# EasyEDA Pro project ProProject_FPGA_oscilloscope Analog pre circuit PCB_2024-05-13.epro, board PCB3
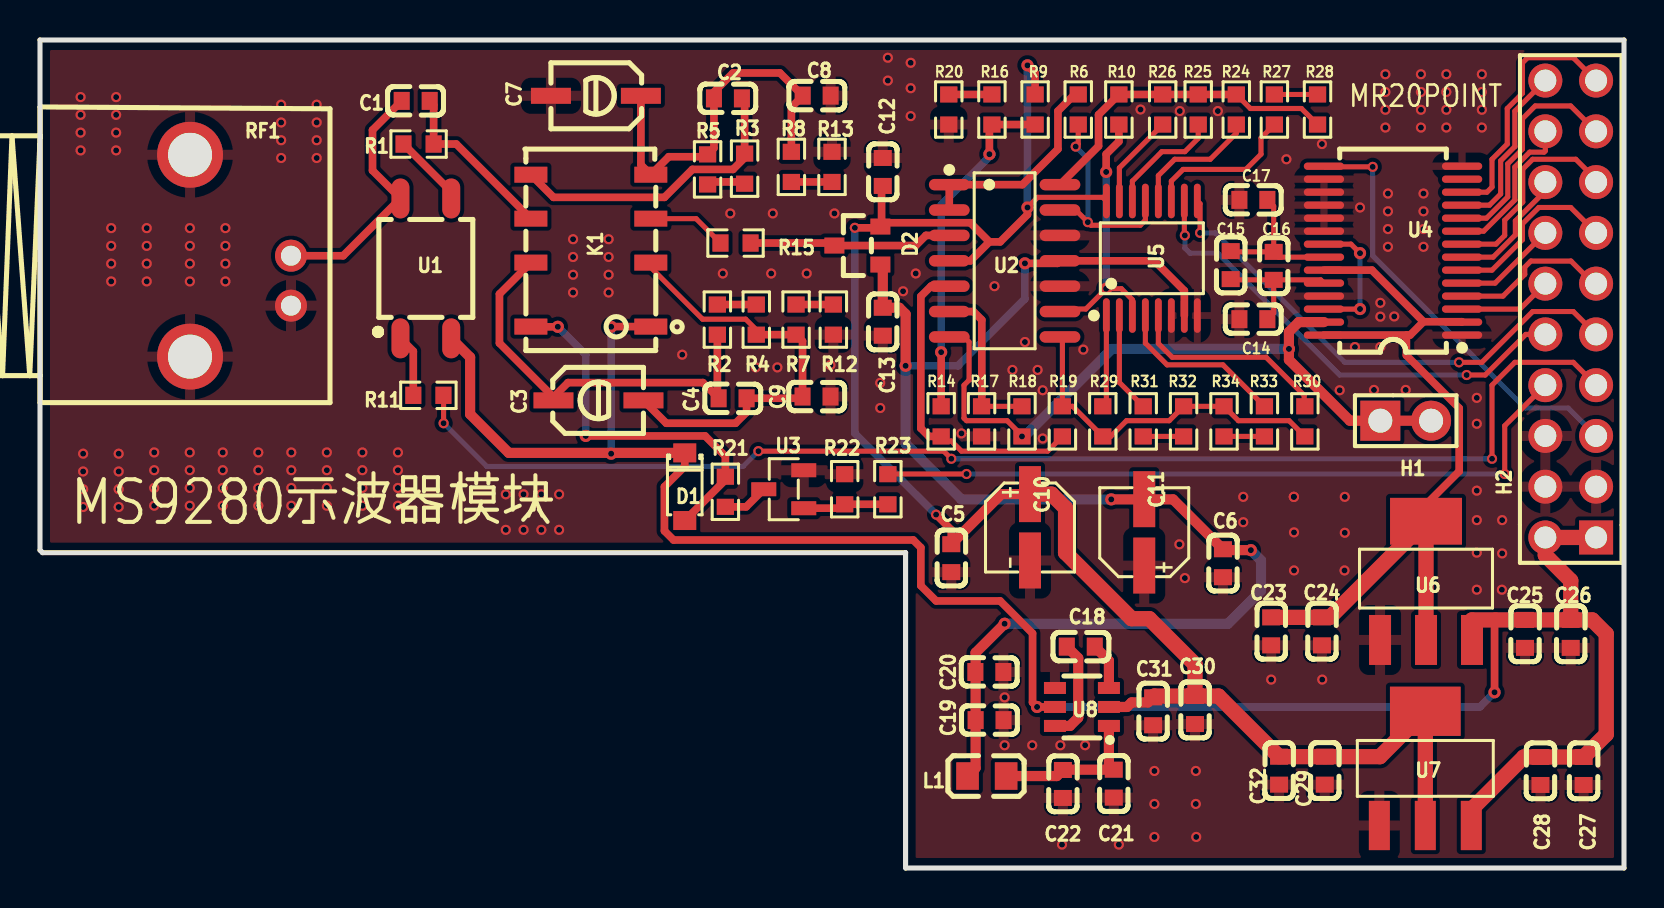
[diagram p5: board, top side]
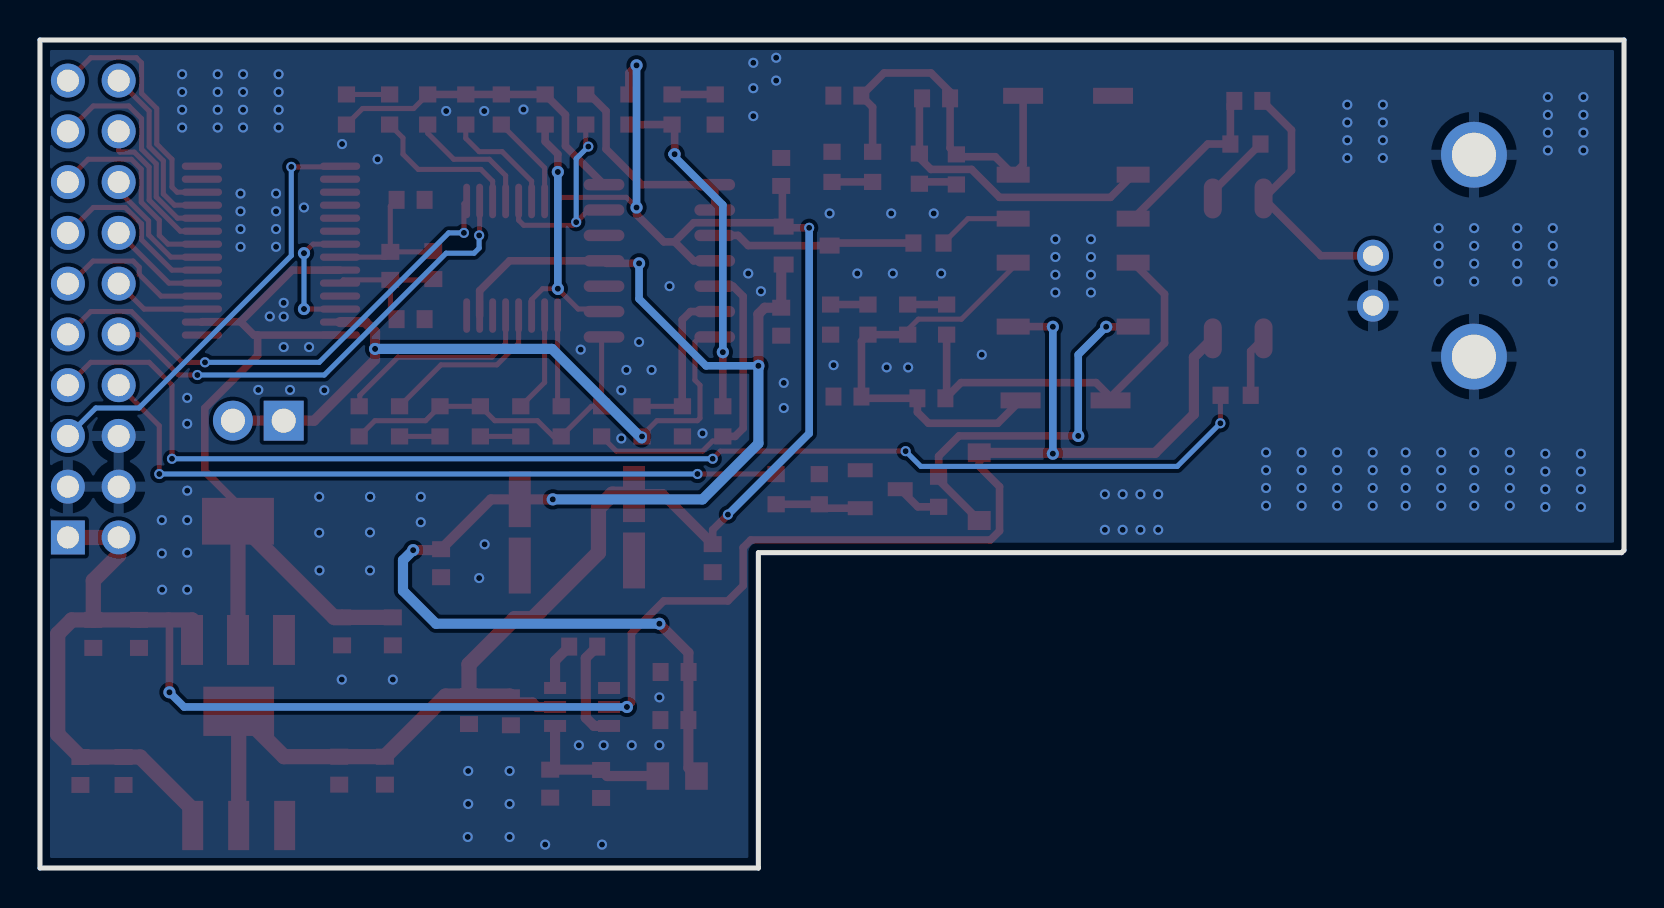
[diagram p6: board, bottom side, seen from below]

Outline 79.25 x 41.43 mm; copper layers: Top Layer, Bottom Layer. Coordinates in mm from the lower left corner of the outline.
Outline path: 0,41.43 79.25,41.43 79.25,0 43.31,0 43.31,15.78 0.13,15.78 0,15.91 0,41.43
Stack: Top Layer 0.035mm / Dielectric1 1.51mm FR4 er 4.5 / Bottom Layer 0.035mm

## Design rules (mm)
template: JLCPCB Capability(Two Layers Board)
spacing copperThickness1oz (default): track to track 0.102, other pairs 0.152 to 0.3
spacing copperThickness2oz: track to track 0.203, other pairs 0.152 to 0.3
track width copperThickness1oz (default): min 0.127, default 0.254, max 2.54
track width copperThickness2oz: min 0.203, default 0.254, max 2.54
differential pair differentialPair (default): width min 0.127, default 0.254, max 2.54; gap min 0.152, default 0.152
via viaSize (default): diameter min 0.5, default 0.61, max 10; hole min 0.3, default 0.305, max 6.3

## Placement (name value [footprint] x y rotation side)
C1  22nF  [C0603]  18.8 38.38 0 top
C2  360pf  [C0603]  34.42 38.51 0 top
C3  -  [CAP-SMD_L4.50-W3.20]  27.94 23.4 0 top
C4  15Pf  [C0603]  34.65 23.5 180 top
C5  104pf  [C0603]  45.59 15.5 270 top
C6  104pf  [C0603]  59.18 15.25 270 top
C7  -  [CAP-SMD_L4.50-W3.20]  27.81 38.64 180 top
C8  15Pf  [C0603]  38.86 38.65 180 top
C9  360pf  [C0603]  38.85 23.59 180 top
C10  22uF  [CAP-SMD_BD4.0-L4.3-W4.3-FD-A]  49.53 17.05 270 top
C11  22uF  [CAP-SMD_BD4.0-L4.3-W4.3-FD-A]  55.25 16.79 90 top
C12  360pf  [C0603]  42.16 34.83 270 top
C13  360pf  [C0603]  42.16 27.34 90 top
C14  100nf  [C0603]  60.71 27.46 0 top
C15  100nf  [C0603]  59.57 30.17 270 top
C16  10uf  [C0603]  61.72 30.13 270 top
C17  100nf  [C0603]  60.71 33.43 0 top
C18  47uf  [C0603]  52.07 11.08 180 top
C19  10uf  [C0603]  47.51 7.4 0 top
C20  47uf  [C0603]  47.5 9.81 0 top
C21  10uf  [C0603]  53.72 4.22 270 top
C22  4.7uf  [C0603]  51.18 4.21 270 top
C23  100nf  [C0603]  61.59 11.84 270 top
C24  22uf  [C0603]  64.13 11.84 270 top
C25  10uf  [C0603]  74.3 11.71 270 top
C26  100nf  [C0603]  76.58 11.71 270 top
C27  100nf  [C0603]  77.23 4.86 270 top
C28  10uf  [C0603]  75.07 4.86 270 top
C29  22uf  [C0603]  64.28 4.87 270 top
C30  10uf  [C0603]  57.78 7.9 270 top
C31  47uf  [C0603]  55.69 7.84 270 top
C32  100nf  [C0603]  61.99 4.87 270 top
D1  1N4148W  [SOD-123_L2.8-W1.8-LS3.7-RD]  32.26 19.08 270 top
D2  BAV199LT1G  [SOT-23_L2.9-W1.3-P1.90-LS2.4-BR]  40.89 31.15 0 top
H1  PZ254V-11-02P  [HDR-TH_2P-P2.54-V-M]  68.33 22.38 0 top
H2  PZ254V-12-20P  [HDR-TH_20P-P2.54-V-M-R2-C10-S2.54]  76.58 27.97 90 top
K1  HFD4/3-S1R  [RELAY-SMD_HFD4-3-S1R]  27.56 30.89 90 top
L1  YI201209U121-5R0T  [L0805]  47.37 4.6 0 top
R1  56Ω  [R0603]  18.94 36.23 180 top
R2  680kΩ  [R0603]  33.89 27.44 270 top
R3  300kΩ  [R0603]  35.25 34.99 90 top
R4  300kΩ  [R0603]  35.84 27.44 90 top
R5  300kΩ  [R0603]  33.4 34.96 270 top
R6  1.5kΩ  [R0603]  51.94 37.95 90 top
R7  4kΩ  [R0603]  37.83 27.44 270 top
R8  200kΩ  [R0603]  37.59 35.08 90 top
R9  1.5kΩ  [R0603]  49.78 37.95 90 top
R10  1.5kΩ  [R0603]  53.97 37.95 90 top
R11  1kΩ  [R0603]  19.43 23.65 180 top
R12  16kΩ  [R0603]  39.69 27.44 90 top
R13  200kΩ  [R0603]  39.62 35.08 270 top
R14  200kΩ  [R0603]  45.09 22.35 90 top
R15  100R  [R0603]  34.8 31.27 0 top
R16  3kΩ  [R0603]  47.62 37.95 270 top
R17  200kΩ  [R0603]  47.11 22.35 90 top
R18  200kΩ  [R0603]  49.13 22.35 90 top
R19  200kΩ  [R0603]  51.15 22.35 270 top
R20  3kΩ  [R0603]  45.47 37.95 90 top
R21  100R  [R0603]  34.29 18.83 270 top
R22  10K  [R0603]  40.26 18.95 270 top
R23  100R  [R0603]  42.42 18.95 270 top
R24  1.5kΩ  [R0603]  59.85 37.95 90 top
R25  1.5kΩ  [R0603]  57.95 37.95 90 top
R26  3kΩ  [R0603]  56.17 37.95 90 top
R27  3kΩ  [R0603]  61.76 37.95 90 top
R28  1.5kΩ  [R0603]  63.91 37.95 270 top
R29  1.5kΩ  [R0603]  53.17 22.35 270 top
R30  3kΩ  [R0603]  63.28 22.35 270 top
R31  3kΩ  [R0603]  55.19 22.35 270 top
R32  1.5kΩ  [R0603]  57.21 22.35 90 top
R33  3kΩ  [R0603]  61.26 22.35 270 top
R34  3kΩ  [R0603]  59.24 22.35 90 top
RF1  KH-BNC75-3511  [ANT-TH_KH-BNC75-3511]  10.03 30.64 270 top
U1  AQY282SX  [SOP-4_L4.3-W4.4-P2.54-LS7.0-BL]  19.3 30 0 top
U2  GS8094-SR  [SOIC-14_L8.7-W3.9-P1.27-LS6.0-BL]  48.26 30.38 270 top
U3  SI2302ADS-T1-JSM  [SOT-23-3_L2.9-W1.3-P1.90-LS2.4-BR]  37.21 18.95 0 top
U4  MS9280  [SSOP-28_L10.2-W5.3-P0.65-LS7.8-BL]  67.69 30.89 90 top
U5  74HC4052PW,118  [TSSOP-16_L5.0-W4.4-P0.65-LS6.4-BL]  55.63 30.51 0 top
U6  AMS1117-3.3  [SOT-223-3_L6.5-W3.5-P3.05-LS7.0]  69.34 14.38 270 top
U7  AMS1117-2.5V  [SOT-223_L6.5-W3.5-P2.30-LS7.0-BR]  69.31 4.99 270 top
U8  SGM3204YN6G/TR  [SOT-23-6_L2.9-W1.6-P0.95-LS2.8-BR]  52.13 8.06 0 top

## Footprints (pads in the part's own frame, mm; a bottom-side part is the same pattern mirrored in y, then rotated)
ANT-TH_KH-BNC75-3511
  round 1.6 hole 1: 1(0,2.525) 2(2.5,2.525)
  round 3.3 hole 2.2: 3(5.05,-2.525) 4(-5.05,-2.525)
C0603
  rect 0.8x0.9 smd: 1(-0.7,0) 2(0.7,0)
CAP-SMD_BD4.0-L4.3-W4.3-FD-A
  rect 2.8x1.1 smd: 1(-1.661,0) 2(1.661,0)
CAP-SMD_L4.50-W3.20
  rect 2x0.8 smd: 1(-2.25,0) 2(2.25,0)
HDR-TH_2P-P2.54-V-M
  rect 2x2 hole 1.2: 1(-1.27,0)
  round 2 hole 1.2: 2(1.27,0)
HDR-TH_20P-P2.54-V-M-R2-C10-S2.54
  rect 1.7x1.7 hole 1.1: 1(-11.43,-1.27)
  round 1.7 hole 1.1: 2(-11.43,1.27) 3(-8.89,-1.27) 4(-8.89,1.27) 5(-6.35,-1.27) 6(-6.35,1.27) 7(-3.81,-1.27) 8(-3.81,1.27) 9(-1.27,-1.27) 10(-1.27,1.27) 11(1.27,-1.27) 12(1.27,1.27) 13(3.81,-1.27) 14(3.81,1.27) 15(6.35,-1.27) 16(6.35,1.27) 17(8.89,-1.27) 18(8.89,1.27) 19(11.43,-1.27) 20(11.43,1.27)
L0805
  rect 1.133x1.377 smd: 1(-0.966,0) 2(0.966,0)
R0603
  rect 0.806x0.864 smd: 1(-0.753,0) 2(0.753,0)
RELAY-SMD_HFD4-3-S1R
  rect 0.8x1.65 smd: 1(-3.8,-3) 2(-0.6,-3) 3(1.6,-3) 4(3.8,-3) 5(3.8,3) 6(1.6,3) 7(-0.6,3) 8(-3.8,3)
SOD-123_L2.8-W1.8-LS3.7-RD
  rect 0.95x1.15 smd: 1(-1.692,0) 2(1.692,0)
SOIC-14_L8.7-W3.9-P1.27-LS6.0-BL
  oval 0.574x2.038 smd: 1(-3.81,-2.769) 2(-2.54,-2.769) 3(-1.27,-2.769) 4(0,-2.769) 5(1.27,-2.769) 6(2.54,-2.769) 7(3.81,-2.769) 8(3.81,2.769) 9(2.54,2.769) 10(1.27,2.769) 11(0,2.769) 12(-1.27,2.769) 13(-2.54,2.769) 14(-3.81,2.769)
SOP-4_L4.3-W4.4-P2.54-LS7.0-BL
  oval 0.9x2 smd: 1(-1.27,-3.5) 2(1.27,-3.5) 3(1.27,3.5) 4(-1.27,3.5)
SOT-23-3_L2.9-W1.3-P1.90-LS2.4-BR
  rect 1.25x0.7 smd: 1(1,-0.95) 2(1,0.95) 3(-1,0)
SOT-23-6_L2.9-W1.6-P0.95-LS2.8-BR
  rect 1.1x0.6 smd: 1(1.35,-0.95) 2(1.35,0) 3(1.35,0.95) 4(-1.35,0.95) 5(-1.35,0) 6(-1.35,-0.95)
SOT-23_L2.9-W1.3-P1.90-LS2.4-BR
  rect 1x0.8 smd: 1(1.15,-0.95) 2(1.15,0.95) 3(-1.15,0)
SOT-223-3_L6.5-W3.5-P3.05-LS7.0
  rect 2.5x1.1 smd: 1(2.97,-2.3) 2(2.97,0) 3(2.97,2.3)
  rect 2.34x3.6 smd: 4(-2.97,0)
SOT-223_L6.5-W3.5-P2.30-LS7.0-BR
  rect 2.465x1.05 smd: 1(2.857,-2.3) 2(2.857,0) 3(2.857,2.3)
  rect 2.465x3.54 smd: 4(-2.857,0)
SSOP-28_L10.2-W5.3-P0.65-LS7.8-BL
  oval 0.364x2.015 smd: 1(-4.225,-3.455) 2(-3.575,-3.455) 3(-2.925,-3.455) 4(-2.275,-3.455) 5(-1.625,-3.455) 6(-0.975,-3.455) 7(-0.325,-3.455) 8(0.325,-3.455) 9(0.975,-3.455) 10(1.625,-3.455) 11(2.275,-3.455) 12(2.925,-3.455) 13(3.575,-3.455) 14(4.225,-3.455) 15(4.225,3.455) 16(3.575,3.455) 17(2.925,3.455) 18(2.275,3.455) 19(1.625,3.455) 20(0.975,3.455) 21(0.325,3.455) 22(-0.325,3.455) 23(-0.975,3.455) 24(-1.625,3.455) 25(-2.275,3.455) 26(-2.925,3.455) 27(-3.575,3.455) 28(-4.225,3.455)
TSSOP-16_L5.0-W4.4-P0.65-LS6.4-BL
  oval 0.343x1.732 smd: 1(-2.275,-2.866) 2(-1.625,-2.866) 3(-0.975,-2.866) 4(-0.325,-2.866) 5(0.325,-2.866) 6(0.975,-2.866) 7(1.625,-2.866) 8(2.275,-2.866) 9(2.275,2.866) 10(1.625,2.866) 11(0.975,2.866) 12(0.325,2.866) 13(-0.325,2.866) 14(-0.975,2.866) 15(-1.625,2.866) 16(-2.275,2.866)

## Nets
2.5V: C5.1 C10.1 C12.2 C29.1 C30.1 C31.1 C32.1 D2.2 R9.2 U2.4 U5.16 U7.2 U7.4 U8.2
+5V: C25.1 C26.1 C27.1 C28.1 D1.1 H2.1 H2.2 K1.1 U1.2 U6.3 U7.3 U8.5
-2.5V: C6.1 C11.2 C13.2 C19.1 C20.1 D2.1 L1.1 U2.11 U5.7
GND: C5.2 C6.2 C7.2 C8.1 C9.1 C10.2 C11.1 C12.1 C13.1 C14.1 C17.1 C19.2 C20.2 C21.2 C22.2 C23.2 C24.2 C25.2 C26.2 C27.2 C28.2 C29.2 C30.2 C31.2 C32.2 H2.3 H2.4 H2.6 R12.1 R13.1 R17.1 R20.1 R22.1 RF1.2 RF1.3 RF1.4 U2.10 U2.12 U3.2 U4.1 U4.14 U4.16 U4.17 U4.18 U4.19 U4.20 U4.25 U5.6 U5.8 U6.1 U7.1 U8.4
1Y0: R24.1 U5.12
1Y1: R25.1 U5.14
1Y2: R26.1 U5.15
1Y3: R27.1 U5.11
1Z: R6.1 U2.13 U5.13
2Y0: R29.1 U5.1
2Y1: R30.1 U5.5
2Y2: R31.1 U5.2
2Y3: R33.1 U5.4
2Z: R10.1 U2.9 U5.3
3.3: C23.1 C24.1 U4.2 U4.23 U4.28 U6.2 U6.4
ADC0_CLK: H2.5 U4.15
AIN: D2.3 R15.2 U2.3
AIN1: H1.1 H1.2 R18.1 U2.7 U4.27
ANGOUT1: R10.2 R24.2 R25.2 R26.2 R28.2 U2.14
ANGOUT2: R19.1 R29.2 R30.2 R32.2 R34.2 U2.8
D0: H2.12 U4.3
D1: H2.11 U4.4
D2: H2.14 U4.5
D3: H2.13 U4.6
D4: H2.16 U4.7
D5: H2.15 U4.8
D6: H2.18 U4.9
D7: H2.17 U4.10
D8: H2.20 U4.11
D9: H2.19 U4.12
DIORA0: H2.7 R11.1
DIORA1: H2.8 R23.1
RE0: D1.2 K1.8 R21.1
S0: H2.10 U5.10
S1: H2.9 U5.9
$3N35195: C1.1 RF1.1 U1.4
$3N35197: R11.2 U1.1
$3N35200: R1.2 U1.3
$3N35204: C3.1 C4.2 K1.7 R2.2
$3N35211: K1.3 R15.1
$3N35218: R22.2 R23.2 U3.1
$3N35226: R21.2 U3.3
$3N35246: C3.2 C4.1 C9.2 K1.2 R4.1 R7.2
$3N35248: R7.1 R12.2
$3N35270: U4.21 U4.26
$3N35357: C21.1 C22.1 L1.2 U8.1
$3N35372: C14.2 C15.2 C16.2 U4.24
$3N35381: C15.1 C16.1 C17.2 U4.22
$3N35397: C18.2 U8.6
$3N35399: C18.1 U8.3
$3N35401: C2.1 C7.1 C8.2 K1.4 R5.1 R8.2
$3N35428: R6.2 U2.1 U2.2
$3N35475: R14.1 R19.2 U2.5
$3N35482: R9.1 R14.2 R16.2
$3N35491: R17.2 R18.2 U2.6
$3N35504: R31.2 R32.1
$3N35506: R27.2 R28.1
$3N35528: R33.2 R34.1
$3N35536: R16.1 R20.2
$3N35540: R8.1 R13.2
$3N35542: R3.1 R5.2
$3N35544: R2.1 R4.2
$3N35546: C1.2 K1.6 R1.1
$3N35551: C2.2 K1.5 R3.2

Pads without a net: U4 13

## Via types
v1: diameter 0.508, hole 0.3, Top Layer to Bottom Layer, 204 vias
v2: diameter 0.61, hole 0.305, Top Layer to Bottom Layer, 20 vias

## Routing (per net, layer and track width the routed paths; a pad name or vN(x,y) marks a point on that pad's centre or on a via; arc(x,y) is an arc through that point)
2.5V: length 89
  Top Layer w0.254: v2(49.4,33.05) 49.91,33.56 53.17,33.56 U5.16
  Top Layer w0.381: v2(49.4,40.16) 49.78,39.78 R9.2 ; v2(49.4,33.05) 49.4,32.7 48.04,31.33 47.5,31.33 ; 47.5,31.33 46.54,32.29 42.24,32.29 42.1,32.16 ; 47.5,31.33 46.55,30.38 45.49,30.38 ; 42.1,32.16 42.1,32.03 ; 42.1,32.16 42.1,34.07 C12.2 ; 42.1,32.03 D2.2 ; 42.1,32.03 v1(40.77,32.03) ; v1(44.83,17.68) 45.59,16.92 C5.1
  Top Layer w0.508: C31.1 55.43,8.29 54.61,8.29 54.38,8.06 U8.2 ; C5.1 48.1,18.71 C10.1
  Top Layer w0.762: C30.1 58.96,8.6 C32.1 C29.1 67.04,5.57 U7.4 U7.2 ; C30.1 57.78,10.19 55.5,12.48 54.61,12.48 51.31,15.78 51.31,18.01 50.61,18.71 C10.1 ; C30.1 55.75,8.6 C31.1
  Bottom Layer w0.381: v1(44.83,17.68) 40.77,21.75 v1(40.77,32.03) ; v2(49.4,33.05) v2(49.4,40.16)
+5V: length 110.9
  Top Layer w0.381: U8.5 v2(49.88,8.06) 49.66,8.29 49.66,11.74 48.03,13.37 44.83,13.37 44.07,14.13 44.07,16.03 43.69,16.41 31.7,16.41 31.24,16.87 31.24,19.08 32.26,20.1 D1.1 ; v2(28.58,27.08) 28.59,27.09 K1.1 ; 28.56,20.77 28.56,20.75 v2(28.58,20.73) ; v2(72.77,8.79) 72.77,12.37 72.82,12.41
  Top Layer w0.508: U1.2 21.52,25.56 21.52,22.71 23.45,20.77 D1.1
  Top Layer w0.762: C26.1 C25.1 71.64,12.41 U6.3 ; C26.1 76.58,14.38 75.31,15.65 H2.2 H2.1 ; C26.1 77.66,12.41 78.36,11.71 78.36,6.69 C27.1 C28.1 74.24,5.56 71.61,2.93 U7.3
  Bottom Layer w0.381: v2(49.88,8.06) 72.04,8.06 v2(72.77,8.79) ; v2(28.58,27.08) v2(28.58,20.73)
-2.5V: length 72.6
  Top Layer w0.381: U5.7 57.25,28.89 55.75,30.38 U2.11 50.9,30.26 v2(49.28,30.26)
  Top Layer w0.508: v2(43.31,25.13) 43.31,27.72 42.99,28.04 C13.2 42.16,30.08 D2.1 ; v2(48.26,12.22) 46.81,10.77 46.81,9.8 ; v2(60.58,15.91) 59.23,15.91 C6.1 56.69,18.45 v2(53.59,18.45) ; L1.1 46.81,5.01 C19.1 46.81,9.8 ; 46.81,9.8 C20.1
  Bottom Layer w0.381: v2(49.28,30.26) 49.28,28.48 45.93,25.13 v2(43.31,25.13)
  Bottom Layer w0.508: v2(60.58,15.91) 61.09,15.4 61.09,13.87 59.44,12.22 v2(48.26,12.22) ; v2(53.59,18.45) 46.1,18.45 43.31,21.24 v2(43.31,25.13)
GND:
  vias: v1(2.03,38.58) v1(2.03,37.69) v1(2.03,36.8) v1(2.03,35.91) v1(2.16,20.73) v1(2.16,19.84) v1(2.16,18.95) v1(2.16,18.06) v1(3.56,32.02) v1(3.56,31.13) v1(3.56,30.24) v1(3.56,29.35) v1(3.81,38.58) v1(3.81,37.69) v1(3.81,36.8) v1(3.81,35.91) v1(3.94,20.73) v1(3.94,19.84) v1(3.94,18.95) v1(3.94,18.06) v1(5.34,32.02) v1(5.34,31.13) v1(5.34,30.24) v1(5.34,29.35) v1(5.72,20.8) v1(5.72,19.91) v1(5.72,19.02) v1(5.72,18.13) v1(7.5,32.02) v1(7.5,31.13) v1(7.5,30.24) v1(7.5,29.35) v1(7.49,20.8) v1(7.49,19.91) v1(7.49,19.02) v1(7.49,18.13) v1(9.14,20.8) v1(9.14,19.91) v1(9.14,19.02) v1(9.14,18.13) v1(9.28,32.02) v1(9.28,31.13) v1(9.28,30.24) v1(9.28,29.35) v1(10.92,20.8) v1(10.92,19.91) v1(10.92,19.02) v1(10.92,18.13) v1(12.06,38.19) v1(12.06,37.3) v1(12.06,36.42) v1(12.06,35.53) v1(12.57,20.8) v1(12.57,19.91) v1(12.57,19.02) v1(12.57,18.13) v1(13.84,38.19) v1(13.84,37.3) v1(13.84,36.42) v1(13.84,35.53) v1(14.35,20.8) v1(14.35,19.91) v1(14.35,19.02) v1(14.35,18.13) v1(16.13,20.8) v1(16.13,19.91) v1(16.13,19.02) v1(16.13,18.13) v1(17.91,20.8) v1(17.91,19.91) v1(17.91,19.02) v1(17.91,18.13) v1(23.3,18.7) v1(23.3,16.92) v1(24.19,18.7) v1(24.19,16.92) v1(25.08,18.7) v1(25.08,16.92) v1(25.97,18.7) v1(25.97,16.92) v1(26.67,31.46) v1(26.67,30.57) v1(26.67,29.69) v1(26.67,28.8) v1(28.45,31.46) v1(28.45,30.57) v1(28.45,29.69) v1(28.45,28.8) v1(32.13,25.68) v1(34.16,29.75) v1(34.53,32.75) v1(35.81,25.05) v1(36.58,29.75) v1(36.66,32.75) v1(36.89,25.05) v1(38.36,29.75) v1(39.55,25.16) v1(39.74,32.75) v1(42.04,24.27) v1(42.04,23.02) v1(42.42,40.54) v1(42.42,39.4) v1(43.18,28.86) v1(43.56,40.29) v1(43.56,39.02) v1(43.56,37.62) v1(43.81,29.75) v1(46.1,21.75) v1(47.75,29.11) v1(48.26,8.54) v1(48.26,6.14) v1(48.65,24.92) v1(49.28,26.32) v1(49.64,6.14) v1(49.91,24.92) v1(50.16,23.91) v1(50.16,21.49) v1(51.05,6.14) v1(51.13,1.17) v1(52.2,25.94) v1(52.29,6.14) v1(53.97,1.17) v1(55.06,37.95) v1(55.75,4.86) v1(55.75,3.21) v1(55.75,1.55) v1(57.02,37.88) v1(57,16.2) v1(57.28,14.51) v1(57.83,4.86) v1(57.83,3.21) v1(57.85,1.55) v1(58.93,37.88) v1(60.2,18.57) v1(60.2,17.3) v1(61.59,9.43) v1(62.36,35.46) v1(62.73,18.57) v1(62.73,18.57) v1(62.74,16.79) v1(62.74,14.89) v1(64.13,36.23) v1(64.15,9.43) v1(65.02,23.91) v1(65.28,18.57) v1(65.28,16.78) v1(65.26,14.89) v1(65.79,26.07) v1(66.04,33.05) v1(66.74,23.92) v1(67.06,28.28) v1(67.06,27.59) v1(67.06,26.07) v1(67.31,39.72) v1(67.31,38.83) v1(67.31,37.94) v1(67.31,37.05) v1(67.44,33.75) v1(67.44,32.86) v1(67.44,31.97) v1(67.44,31.08) v1(67.75,27.6) v1(68.33,23.92) v1(69.09,39.72) v1(69.09,38.83) v1(69.09,37.94) v1(69.09,37.05) v1(69.22,33.75) v1(69.22,32.86) v1(69.22,31.97) v1(69.22,31.08) v1(70.36,39.72) v1(70.36,38.83) v1(70.36,37.94) v1(70.36,37.05) v1(71.88,23.53) v1(71.88,22.23) v1(71.88,18.88) v1(71.88,17.41) v1(71.88,15.78) v1(71.88,13.93) v1(72.14,39.72) v1(72.14,38.83) v1(72.14,37.94) v1(72.14,37.05) v1(73.14,13.93) v1(73.15,17.41) v1(73.15,15.74)
1Y0: length 6.5
  Top Layer w0.254: R24.1 59.85,36.77 58.55,35.46 56.77,35.46 55.95,34.65 U5.12
1Y1: length 5.9
  Top Layer w0.254: U5.14 54.65,34.37 56.13,35.84 57.28,35.84 57.95,36.51 R25.1
1Y2: length 4.7
  Top Layer w0.254: R26.1 54,35.03 U5.15
1Y3: length 7.8
  Top Layer w0.254: U5.11 56.6,34.37 57.19,34.96 60.33,34.96 61.09,35.72 61.09,36.53 R27.1
1Z: length 10.8
  Top Layer w0.254: v1(51.82,36.1) 51.94,36.23 R6.1 ; U2.13 51.82,32.92 52.58,32.16 55.05,32.16 55.3,32.42 U5.13
  Bottom Layer w0.254: v1(52.42,32.32) 52.42,35.49 v1(51.82,36.1)
2Y0: length 4.6
  Top Layer w0.254: U5.1 53.35,23.28 R29.1
2Y1: length 10.3
  Top Layer w0.254: U5.5 55.95,26.25 56.64,25.56 61.34,25.56 63.25,23.65 63.25,23.14 R30.1
2Y2: length 5
  Top Layer w0.254: R31.1 54,24.29 U5.2
2Y3: length 8.6
  Top Layer w0.254: U5.4 55.3,26.26 56.39,25.18 59.18,25.18 R33.1
2Z: length 13.7
  Top Layer w0.254: U2.9 51.16,27.97 52.32,27.97 v2(53.34,28.99) 54.1,28.99 54.65,28.44 U5.3
  Top Layer w0.381: v2(53.34,34.83) 53.34,35.72 53.97,36.35 R10.1
  Bottom Layer w0.381: v2(53.34,34.83) 53.34,28.86
3.3: length 40
  Top Layer w0.381: 68.36,26.67 U4.28 ; 68.36,26.67 68.55,26.67 69.22,27.34 ; 68.36,26.67 68.36,25.65 71,23.01 71,19.85 69.34,18.19 U6.4 ; U4.23 66.63,29.92 69.22,27.34 ; 69.22,27.34 71.13,27.34 U4.2
  Top Layer w0.762: C23.1 C24.1 64.53,12.54 U6.4 U6.2
ADC0_CLK: length 21.8
  Top Layer w0.254: v1(66.68,35.08) 64.27,35.08 U4.15
  Bottom Layer w0.254: v1(66.68,35.08) 66.68,30.64 74.3,23.02 76.45,23.02 H2.5
AIN: length 10.2
  Top Layer w0.381: 45.49,31.65 44.32,31.65 43.81,31.15 D2.3 39.62,31.27 R15.2
AIN1: length 35.3
  Top Layer w0.254: 49.13,21.6 49.13,21.64 48.39,22.38 46.35,22.38 46.23,22.51 46.23,24.16 46.48,24.41 46.48,26.32 46.23,26.57 45.49,26.57
  Top Layer w0.508: 49.15,21.49 49.13,21.51 v1(49.13,21.6) 49.13,21.6 ; U4.27 62.97,27.32 62.48,26.83 v2(62.48,25.97) 62.48,25.43 65.53,22.38 H1.1 H1.2
  Bottom Layer w0.508: v2(62.48,25.97) 53.63,25.97 49.15,21.49
ANGOUT1: length 16.3
  Top Layer w0.254: R24.2 60.55,38 63.11,38 R28.2
  Top Layer w0.381: R24.2 R25.2 R26.2 R10.2 52.96,37.69 52.96,36.12 U2.14
ANGOUT2: length 17.5
  Top Layer w0.254: R30.2 62.49,22.38 59.96,22.38 R34.2 R32.2 56.49,22.38 54.36,22.38 53.57,21.6 R29.2 51.66,23.1 R19.1 51.15,26.45 U2.8
D0: length 4.7
  Top Layer w0.254: H2.12 74.04,27.97 U4.3
D1: length 8.1
  Top Layer w0.254: H2.11 77.72,29.24 76.59,30.37 74.59,30.37 74.28,30.06 74.28,29.7 73.19,28.62 U4.4
D2: length 5.2
  Top Layer w0.254: H2.14 72.8,29.27 U4.5
D3: length 9
  Top Layer w0.254: U4.6 72.64,29.92 74.17,31.44 74.17,32.23 74.98,33.05 76.58,33.05 H2.13
D4: length 6.4
  Top Layer w0.254: U4.7 72.7,30.57 73.81,31.68 73.81,32.38 75.31,33.88 H2.16
D5: length 10.4
  Top Layer w0.254: H2.15 77.85,34.45 76.84,35.46 74.68,35.46 74.18,34.97 74.18,33.32 73.28,32.42 73.28,31.65 72.84,31.22 U4.8
D6: length 7.8
  Top Layer w0.254: H2.18 75.31,35.88 75.25,35.82 74.53,35.82 73.79,35.08 73.79,33.43 72.23,31.87 U4.9
D7: length 11.4
  Top Layer w0.254: U4.10 72.37,32.52 73.43,33.58 73.43,35.23 74.17,35.97 74.17,37.5 74.8,38.13 76.58,38.13 H2.17
D8: length 8.8
  Top Layer w0.254: U4.11 72.52,33.17 73.08,33.73 73.08,35.39 73.79,36.1 73.79,37.88 H2.20
D9: length 12.7
  Top Layer w0.254: H2.19 76.71,40.54 74.42,40.54 74.17,40.29 74.17,38.77 73.41,38 73.41,36.23 72.64,35.46 72.64,34.07 72.39,33.82 U4.12
DIORA0: length 65.1
  Top Layer w0.254: v1(20.19,22.26) 20.19,23.64 R11.1 ; v1(45.59,20.48) 45.21,20.86 v1(35.94,20.86) ; H2.7 76.71,25.3 73.79,25.3 72.64,24.16 v1(72.64,20.48)
  Bottom Layer w0.254: v1(35.94,20.86) 35.18,20.1 22.35,20.1 v1(20.19,22.26) ; v1(72.64,20.48) v1(45.59,20.48)
DIORA1: length 36.2
  Top Layer w0.254: v1(46.35,19.72) 42.43,19.72 R23.1 ; v1(73.28,19.72) 73.28,22.13 H2.8
  Bottom Layer w0.254: v1(73.28,19.72) v1(46.35,19.72)
RE0: length 18.9
  Top Layer w0.381: D1.2 34.29,19.42 R21.1 34.29,20.6 33.27,21.62 v2(27.31,21.62) ; K1.8 24.57,27.08 v2(25.91,27.08)
  Bottom Layer w0.381: v2(27.31,21.62) 27.31,25.68 v2(25.91,27.08)
S0: length 23.9
  Top Layer w0.254: v1(71.37,24.67) 72.3,24.67 74.33,26.7 H2.10 ; U5.10 57.25,31.68 v1(57.28,31.65)
  Bottom Layer w0.254: v1(57.28,31.65) 57.28,31.02 57.53,30.76 58.93,30.76 65.02,24.67 v1(71.37,24.67)
S1: length 25.7
  Top Layer w0.254: H2.9 76.71,27.84 74.68,27.84 72.14,25.3 v1(70.99,25.3) ; U5.9 58.04,33.24 v1(58.04,31.78)
  Bottom Layer w0.254: v1(58.04,31.78) 58.8,31.78 65.28,25.3 v1(70.99,25.3)
$3N35195: length 12.7
  Top Layer w0.381: RF1.1 15.17,30.64 U1.4 16.64,34.9 16.64,36.93 C1.1
$3N35197: length 3.1
  Top Layer w0.381: U1.1 18.68,25.86 R11.2
$3N35200: length 3.7
  Top Layer w0.381: U1.3 20.57,33.84 R1.2
$3N35204: length 20.7
  Top Layer w0.381: 33.89,23.57 C4.2 ; 33.89,23.57 R2.2 ; 33.89,23.57 33.17,24.29 26.42,24.29 25.69,23.56 ; K1.7 22.99,28.72 22.99,26.26 25.69,23.56 ; 25.69,23.56 C3.1
$3N35211: length 4
  Top Layer w0.254: 30.56,32.49 32.83,32.49 R15.1
$3N35218: length 4.3
  Top Layer w0.381: R23.2 R22.2 40.06,18 U3.1
$3N35226: length 2.3
  Top Layer w0.381: R21.2 35.33,18.07 U3.3
$3N35246: length 21.7
  Top Layer w0.254: R4.1 35.84,26.93 35.31,27.46 33.15,27.46 30.56,30.05 K1.2
  Top Layer w0.381: R4.1 R7.2 38.15,26.36 C9.2 38.06,23.5 C4.1 35.35,22.81 34.8,22.26 31.33,22.26 C3.2
$3N35248: length 1.9
  Top Layer w0.381: R7.1 R12.2
$3N35270: length 6.6
  Top Layer w0.254: v2(66.04,30.76) 65.59,31.22 U4.21 ; U4.26 66.04,27.97 v2(66.04,27.97)
  Bottom Layer w0.254: v2(66.04,27.97) v2(66.04,30.76)
$3N35357: length 7.8
  Top Layer w0.508: L1.2 50.87,4.6 C22.1 51.19,4.92 C21.1 53.48,5.16 U8.1
$3N35372: length 6.8
  Top Layer w0.254: C16.2 59.61,29.43 C15.2 ; C16.2 64.07,29.43 U4.24 ; C16.2 61.72,27.78 C14.2
$3N35381: length 7.5
  Top Layer w0.254: U4.22 61.99,30.57 C16.1 ; C16.1 59.61,30.83 C15.1 ; C16.1 61.72,33.12 C17.2
$3N35397: length 5.1
  Top Layer w0.508: C18.2 51.94,10.51 51.94,7.52 51.53,7.11 U8.6
$3N35399: length 2.4
  Top Layer w0.508: C18.1 53.48,10.37 U8.3
$3N35401: length 19
  Top Layer w0.381: R8.2 37.59,38.07 38.16,38.64 37.02,39.78 34.67,39.78 33.72,38.83 C2.1 33.72,36.03 R5.1 33.28,35.59 31.46,35.59 30.56,34.69 30.06,35.19 C7.1
$3N35428: length 10.7
  Top Layer w0.381: R6.2 51.76,38.71 50.93,37.88 50.93,35.97 49.15,34.19 45.49,34.19 45.49,32.92
$3N35475: length 16.1
  Top Layer w0.254: R19.2 50.41,20.86 46.1,20.86 45.59,21.37 45.31,21.37 R14.1
  Top Layer w0.381: R14.1 44.47,21.6 44.07,22 44.07,28.61 44.58,29.11 45.49,29.11
$3N35482: length 17.5
  Top Layer w0.381: R9.1 R16.2 47.5,37.07 v2(47.5,35.72) ; v2(45.09,25.81) R14.2
  Bottom Layer w0.381: v2(47.5,35.72) 47.62,35.72 45.09,33.18 v2(45.09,25.81)
$3N35491: length 8.1
  Top Layer w0.254: R18.2 R17.2
  Top Layer w0.381: R17.2 47.12,23.11 47.12,27.43 46.7,27.84 45.49,27.84
$3N35504: length 2
  Top Layer w0.254: R32.1 R31.2
$3N35506: length 2.2
  Top Layer w0.254: R27.2 R28.1
$3N35528: length 2
  Top Layer w0.254: R33.2 R34.1
$3N35536: length 2.2
  Top Layer w0.381: R20.2 R16.1
$3N35540: length 2
  Top Layer w0.381: R8.1 R13.2
$3N35542: length 2
  Top Layer w0.381: R3.1 35.16,34.33 33.32,34.33
$3N35544: length 1.9
  Top Layer w0.381: R2.1 R4.2
$3N35546: length 8.7
  Top Layer w0.381: 24.56,32.49 20.83,36.23 R1.1 19.69,38.19 C1.2
$3N35551: length 15
  Top Layer w0.381: 24.56,34.69 25.69,33.56 31.24,33.56 32.64,34.96 34.67,34.96 35.25,35.54 R3.2 35.25,38.38 C2.2

## Copper pours and planes (outline as drawn; the poured copper is in the pictures)
GND on Top Layer: 43.31,0 79.25,0 79.25,41.43 0,41.43 0,16.03 0.13,15.91 43.18,15.91 43.31,15.78
GND on Bottom Layer: 43.31,0 79.25,0 79.25,41.43 0,41.43 0,16.03 0.13,15.91 43.18,15.91 43.31,15.78

## Text on the board
Top Silkscreen Layer: MR20POINT | MS9280示波器模块
